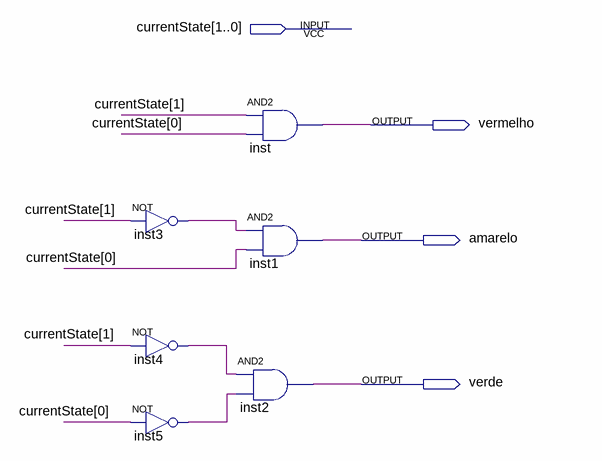
[diagram p0: schematic sheet]
// Quartus schematic outputLogic.bdf as structural Verilog: 6 symbols, 4 pins
module outputLogic (
  input  [1:0] currentState,
  output vermelho,
  output amarelo,
  output verde
);

  wire inst3_out, inst4_out, inst5_out;

  not inst3 (inst3_out, currentState[1]);
  not inst4 (inst4_out, currentState[1]);
  not inst5 (inst5_out, currentState[0]);
  and inst (vermelho, currentState[1], currentState[0]);
  and inst1 (amarelo, inst3_out, currentState[0]);
  and inst2 (verde, inst4_out, inst5_out);
endmodule
